# EAGLE schematic Control-Board-V3-Charging_v21 (EAGLE 9.7.0)
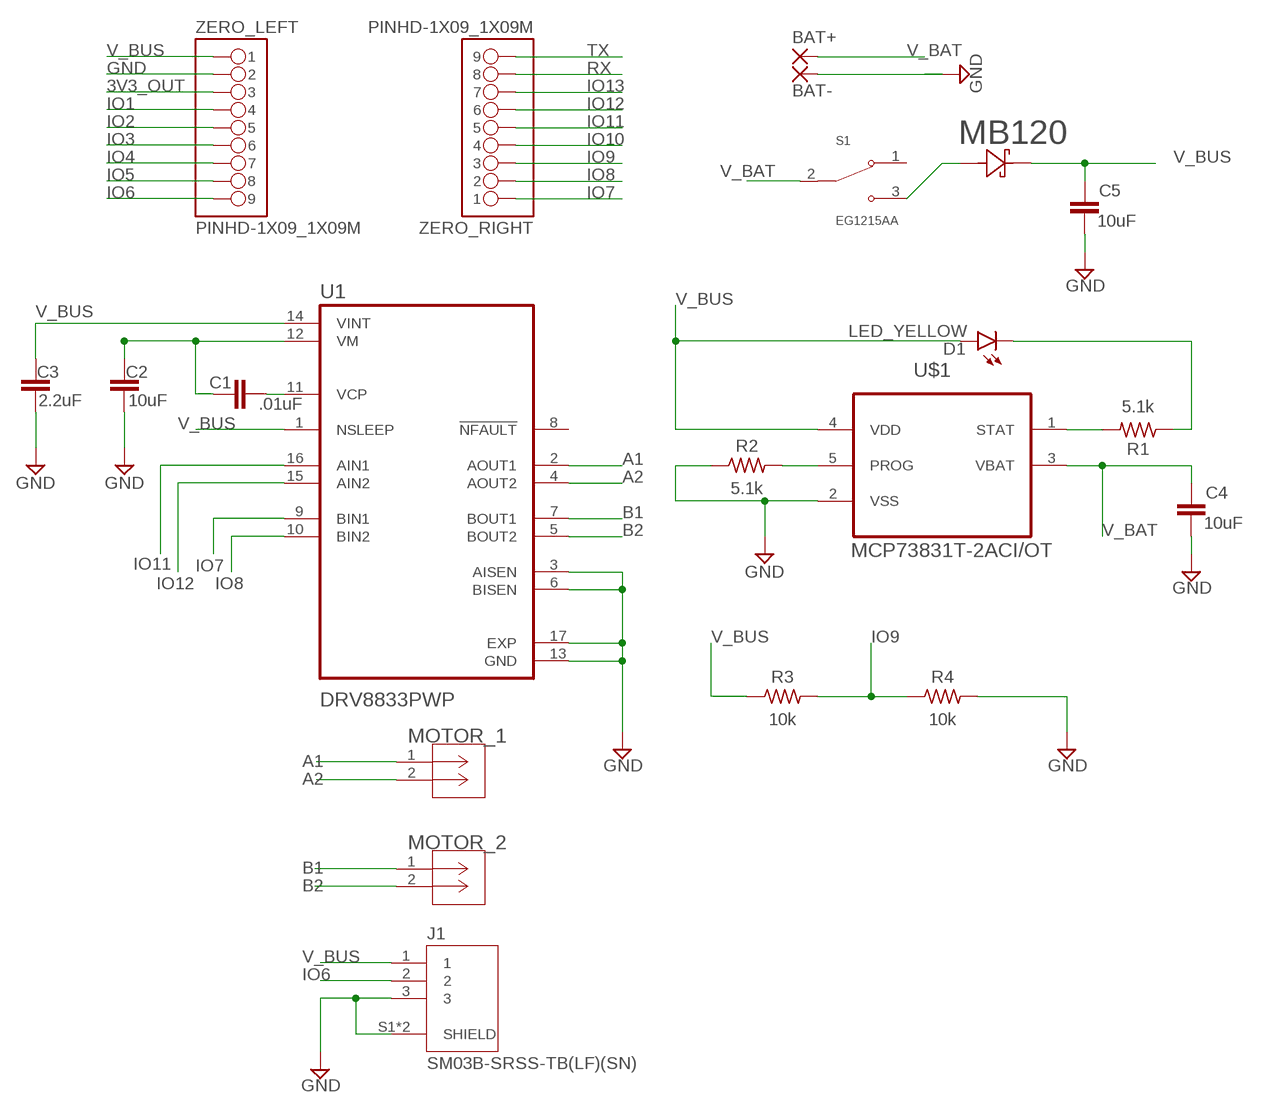
[diagram p0: schematic, sheet 1]

## Parts
BAT+  SMD2  [SMD1,27-2,54]
BAT-  SMD2  [SMD1,27-2,54]
C1  .01uF  C_CHIP-0805(2012-METRIC)  [CAPC2012X110]
C2  10uF  C_CHIP-0805(2012-METRIC)  [CAPC2012X110]
C3  2.2uF  C_CHIP-0805(2012-METRIC)  [CAPC2012X110]
C4  10uF  C_CHIP-0805(2012-METRIC)  [CAPC2012X110]
C5  10uF  C_CHIP-0805(2012-METRIC)  [CAPC2012X110]
D1  LED_YELLOW  CHIP-FLAT-Y_0805  [LEDC2012X110N_FLAT-Y]
J1  SM03B-SRSS-TB(LF)(SN)  [JST_SM03B-SRSS-TB(LF)(SN)]
MB120  MBR120LSFT3GSDO_SOD-123FL(498)_OSI-L  [SDO_SOD-123FL(498)_OSI-L]
MOTOR_1  JST_SH  [JST]
MOTOR_2  JST_SH  [JST]
R1  5.1k  R-US_CHIP-0805(2012-METRIC)  [RESC2012X65]
R2  5.1k  R-US_CHIP-0805(2012-METRIC)  [RESC2012X65]
R3  10k  R-US_CHIP-0805(2012-METRIC)  [RESC2012X65]
R4  10k  R-US_CHIP-0805(2012-METRIC)  [RESC2012X65]
S1  EG1215AA  [SW_EG1215AA]
U1  DRV8833PWP  [IC_DRV8833PWP]
U$1  MCP73831T-2ACI/OT  [SOT95P280X145-5N]
ZERO_LEFT  PINHD-1X09_1X09M  [1X09]
ZERO_RIGHT  PINHD-1X09_1X09M  [1X09]

## Nets
3V3_OUT: ZERO_LEFT.3
A1: MOTOR_1.1 U1.2(AOUT1)
A2: MOTOR_1.2 U1.4(AOUT2)
B1: MOTOR_2.1 U1.7(BOUT1)
B2: MOTOR_2.2 U1.5(BOUT2)
GND: BAT-.1(P) C2.1 C3.1 C4.2 C5.2 J1.3 J1.S1(SHIELD) J1.S2(SHIELD) R2.1 R4.2 U1.3(AISEN) U1.6(BISEN) U1.13(GND) U1.17(EXP) U$1.2(VSS) ZERO_LEFT.2
IO1: ZERO_LEFT.4
IO2: ZERO_LEFT.5
IO3: ZERO_LEFT.6
IO4: ZERO_LEFT.7
IO5: ZERO_LEFT.8
IO6: J1.2 ZERO_LEFT.9
IO7: U1.9(BIN1) ZERO_RIGHT.1
IO8: U1.10(BIN2) ZERO_RIGHT.2
IO9: R3.2 R4.1 ZERO_RIGHT.3
IO10: ZERO_RIGHT.4
IO11: U1.16(AIN1) ZERO_RIGHT.5
IO12: U1.15(AIN2) ZERO_RIGHT.6
IO13: ZERO_RIGHT.7
N$1: C1.2 U1.11(VCP)
N$2: R1.2 U$1.1(STAT)
N$3: D1.C R1.1
N$4: R2.2 U$1.5(PROG)
N$6: MB120.2 S1.3
RX: ZERO_RIGHT.8
TX: ZERO_RIGHT.9
V_BAT: BAT+.1(P) C4.1 S1.2 U$1.3(VBAT)
V_BUS: C1.1 C2.2 C3.2 C5.1 D1.A J1.1 MB120.1 R3.1 U1.1(NSLEEP) U1.12(VM) U1.14(VINT) U$1.4(VDD) ZERO_LEFT.1
Unconnected: S1.1 U1.8(!NFAULT)

## Library data of the parts
BAT+ BAT- = wirepad:SMD2: SMD PAD
C1-C5 = Capacitor:C: Capacitor - Generic; CATEGORY: Capacitor
D1 = LED:CHIP-FLAT-Y; CATEGORY: LED; COLOR: YELLOW; DESCRIPTION: CHIP LED FLAT; SUB-CATEGORY: CHIP; TYPE: FLAT_TOP
J1 = JST-SH/SR-3PIN:SM03B-SRSS-TB(LF)(SN): SH Series 3 Position 1 mm Pitch Surface Mount Side Entry Shrouded Header; CHECK_PRICES: https://www.snapeda.com/parts/SM03B-SRSS-TB(LF)(SN)/JST+Sales+America+Inc./view-part/?ref=eda; DESCRIPTION: Connector Header Surface Mount, Right Angle 3 position 0.039 (1.00mm); MF: JST Sales America Inc.; MP: SM03B-SRSS-TB(LF)(SN); PACKAGE: None; SNAPEDA_LINK: https://www.snapeda.com/parts/SM03B-SRSS-TB(LF)(SN)/JST+Sales+America+Inc./view-part/?ref=snap
MB120 = MB120:MBR120LSFT3G; COPYRIGHT: Copyright (C) 2024 Ultra Librarian. All rights reserved.; MANUFACTURER_PART_NUMBER: MBR120LSFT3G; MFR_NAME: onsemi
MOTOR_1 MOTOR_2 = calico:JST_SH
R1-R4 = Resistor:R-US: Resistor Fixed - ANSI; CATEGORY: Resistor; SUB-CATEGORY: Fixed
S1 = EG1215AA:EG1215AA: Slide Switch SPDT Surface Mount, Right Angle; MANUFACTURER: E Switch; MAXIMUM_PACKAGE_HEIGHT: 1.40mm; PARTREV: A; STANDARD: Manufacturer Recommendations
U1 = calico:DRV8833PWP: 10.8-V, 2-A dual H-bridge motor driver with current regulation 16-HTSSOP -40 to 85; AVAILABILITY: Warning; DESCRIPTION: 10.8-V, 2-A dual H-bridge motor driver with current regulation 16-HTSSOP -40 to 85; DIGIKEY-PURCHASE-URL: https://snapeda.com/shop?store=DigiKey&id=377881; MANUFACTURER: Texas Instruments; MAXIMUM_PACKAGE_HEIGHT: 1.2mm; MOUSER-PURCHASE-URL: https://snapeda.com/shop?store=Mouser&id=377881; MP: DRV8833PWP; PACKAGE: HTSSOP-16 Texas Instruments; PARTREV: E; PRICE: None; STANDARD: Manufacturer Recommendations; TEXAS_INSTRUMENTS-PURCHASE-URL: https://snapeda.com/shop?store=Texas+Instruments&id=377881
U$1 = MCP73831T-2ACI_OT:MCP73831T-2ACI/OT: Charge Management Controller; MPN: MCP73831T-2ACI/OT; OC_FARNELL: 1332158; OC_NEWARK: 56K7045; PACKAGE: SOT-5; SUPPLIER: Microchip
ZERO_LEFT ZERO_RIGHT = Tinkercad:PINHD-1X09